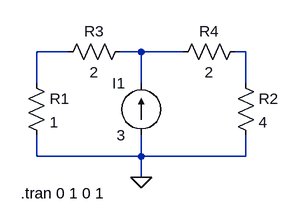
[diagram p0: schematic Circuit_3.asc]
Circuit_3.asc, the LTspice schematic file:
Version 4.1
SHEET 1 880 680
WIRE 96 80 48 80
WIRE 208 80 176 80
WIRE 272 80 208 80
WIRE 368 80 352 80
WIRE 48 128 48 80
WIRE 208 128 208 80
WIRE 368 128 368 80
WIRE 48 240 48 208
WIRE 208 240 208 208
WIRE 208 240 48 240
WIRE 368 240 368 208
WIRE 368 240 208 240
WIRE 208 272 208 240
FLAG 208 272 0
SYMBOL current 208 208 R180
WINDOW 0 24 80 Left 2
WINDOW 3 24 0 Left 2
WINDOW 123 0 0 Left 0
WINDOW 39 0 0 Left 0
SYMATTR InstName I1
SYMATTR Value 3
SYMBOL res 32 112 R0
SYMATTR InstName R1
SYMATTR Value 1
SYMBOL res 352 112 R0
SYMATTR InstName R2
SYMATTR Value 4
SYMBOL res 192 64 R90
WINDOW 0 0 56 VBottom 2
WINDOW 3 32 56 VTop 2
SYMATTR InstName R3
SYMATTR Value 2
SYMBOL res 368 64 R90
WINDOW 0 0 56 VBottom 2
WINDOW 3 32 56 VTop 2
SYMATTR InstName R4
SYMATTR Value 2
TEXT 24 296 Left 2 !.tran 0 1 0 1

The netlist it stands for:
* Circuit_3.asc
I1 0 N002 3
R1 N001 0 1
R2 N003 0 4
R3 N002 N001 2
R4 N003 N002 2
.tran 0 1 0 1
.backanno
.end